# EAGLE design lightningbugsinajar (EAGLE 7.2.0)
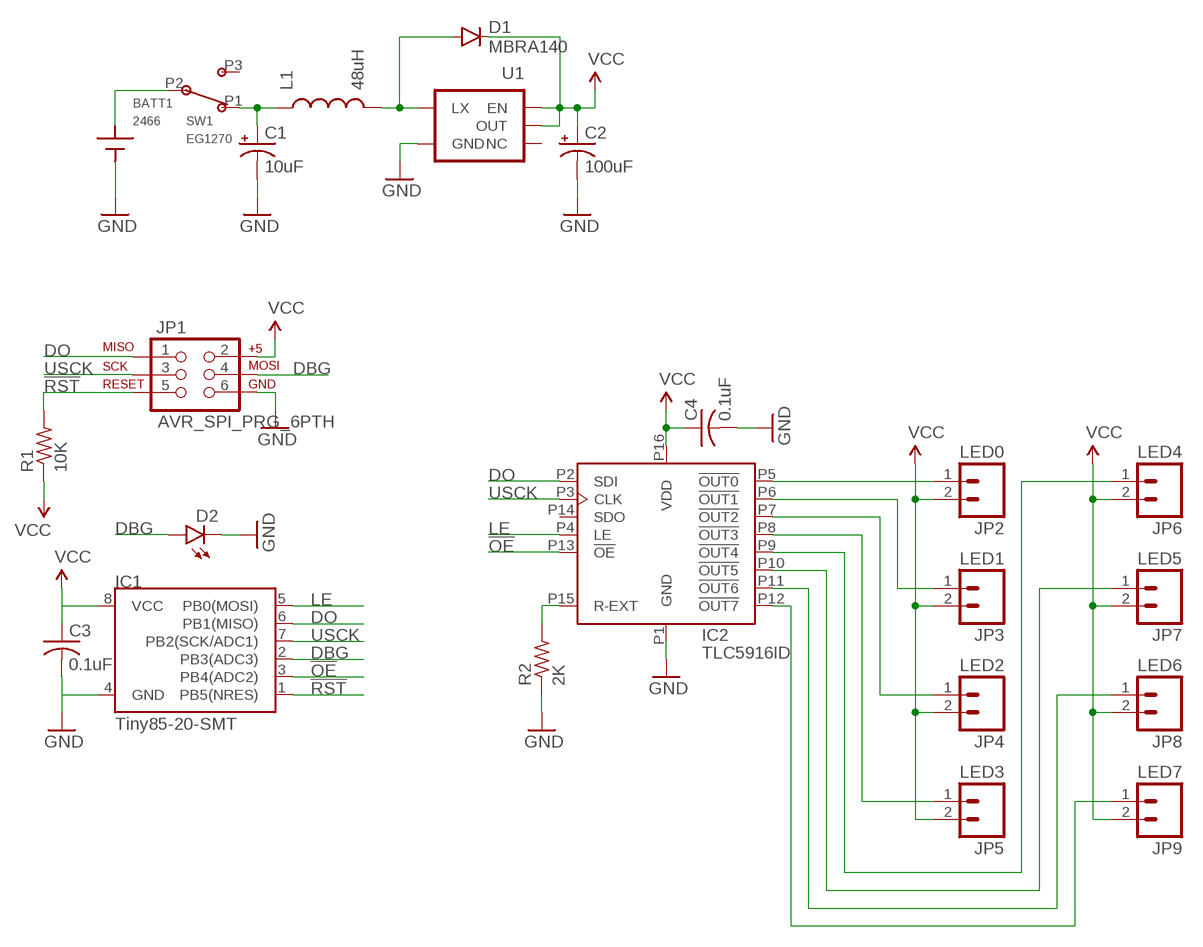
[diagram p0: schematic, sheet 1]

## Parts
BATT1  2466  [2466]
C1  10uF  CAP_POL3528  [EIA3528]
C2  100uF  CAP_POL3528  [EIA3528]
C3  0.1uF  C-USC0805  [C0805]
C4  0.1uF  C-USC0805  [C0805]
D1  MBRA140  DIODESMA  [SMA-DIODE]
D2  LED3MM  [LED3MM]
IC1  Tiny85-20-SMT  ATTINY45TINY85-20-SMT  [SO08-EIAJ]
IC2  TLC5916ID  [SOIC-16]
JP1  AVR_SPI_PRG_6PTH  [2X3]
JP2  LED0  M02PTH  [1X02]
JP3  LED1  M02PTH  [1X02]
JP4  LED2  M02PTH  [1X02]
JP5  LED3  M02PTH  [1X02]
JP6  LED4  M02PTH  [1X02]
JP7  LED5  M02PTH  [1X02]
JP8  LED6  M02PTH  [1X02]
JP9  LED7  M02PTH  [1X02]
L1  48uH  INDUCTORCR54  [CR54]
R1  10K  R-US_R0805  [R0805]
R2  2K  R-US_R0805  [R0805]
SW1  EG1270  [EG1270]
U1  V_REG_NCP1400SOT23-5  [SOT23-5]

## Nets
!OE: IC1.3(PB4(ADC2)) IC2.P13(!OE)
!RST: IC1.1(PB5(NRES)) JP1.5 R1.2
DBG: D2.A IC1.2(PB3(ADC3)) JP1.4
DO: IC1.6(PB1(MISO)) IC2.P2(SDI) JP1.1
GND: BATT1.NEG C1.C(-) C2.C(-) C3.2 C4.2 D2.K(C) IC1.4(GND) IC2.P1(GND) JP1.6 R2.1 U1.4(GND)
LE: IC1.5(PB0(MOSI)) IC2.P4(LE)
N$1: C1.A(+) L1.P$1 SW1.P1
N$2: D1.A L1.P$2 U1.5(LX)
N$3: IC2.P5(!OUT0) JP2.1
N$4: IC2.P15(R-EXT) R2.2
N$5: IC2.P6(!OUT1) JP3.1
N$6: IC2.P7(!OUT2) JP4.1
N$7: IC2.P8(!OUT3) JP5.1
N$8: IC2.P9(!OUT4) JP6.1
N$9: IC2.P10(!OUT5) JP7.1
N$10: BATT1.POS SW1.P2(COM)
N$11: IC2.P11(!OUT6) JP8.1
N$12: IC2.P12(!OUT7) JP9.1
USCK: IC1.7(PB2(SCK/ADC1)) IC2.P3(CLK) JP1.3
VCC: C2.A(+) C3.1 C4.1 D1.C IC1.8(VCC) IC2.P16(VDD) JP1.2 JP2.2 JP3.2 JP4.2 JP5.2 JP6.2 JP7.2 JP8.2 JP9.2 R1.1 U1.1(EN) U1.2(OUT)
Unconnected: IC2.P14(SDO) U1.3(NC)

## Power pins joined to a net without a drawn wire
3: SW1.P3

## Library data of the parts
BATT1 = custom:2466: Keystone Electronics. AAA battery holder.
C1 C2 = SparkFun-Passives:CAP_POL: Capacitor Polarized These are standard SMD and PTH capacitors. Normally 10uF, 47uF, and 100uF in electrolytic and tantalum varieties. Always verify the external diameter of the through hole cap, it varies with capacity, voltage, and manufacturer. The EIA devices should be standard.
C3 C4 = rcl:C-US: CAPACITOR, American symbol
D1 = SparkFun-DiscreteSemi:DIODE: Diode These are standard reverse protection diodes and small signal diodes. SMA package can handle up to about 1A. SOD-323 can handle about 200mA. What the SOD-323 package when ordering, there are some mfgs out there that are 5-pin packages.
D2 = SparkFun-LED:LED: LEDs Standard schematic elements and footprints for 5mm, 3mm, 1206, and 0603 sized LEDs. 5mm - Spark Fun Electronics SKU : COM-00529 (and others)
IC1 = SparkFun-DigitalIC:ATTINY45: Atmel 8-pin 2/4/8kB flash uC; PROD_ID: IC-09092
IC2 = custom:TLC591*?
JP1 = SparkFun-Connectors:AVR_SPI_PRG_6: AVR ISP 6 Pin This is the reduced ISP connector for AVR programming. Common on Arduino. This footprint will take up less PCB space and can be used with a 10-pin to 6-pin adapter such as SKU: BOB-08508 **Special note about "TEST_POINT" package. The stop mask is on the top side, so if you want your programming test points to be on the bottom of your board, make sure to place this package on the bottom side of the board. This also ensure that the orientation to program from the bottom side will be correct.
JP2-JP9 = SparkFun-Connectors:M02: Standard 2-pin 0.1" header. Use with - straight break away headers ( PRT-00116) - right angle break away headers (PRT-00553) - swiss pins (PRT-00743) - machine pins (PRT-00117) - female headers (PRT-00115) Molex polarized connector foot print use with: PRT-08233 with associated crimp pins and housings. 2.54_SCREWTERM for use with PRT-10571. 3.5mm Screw Terminal footprints for PRT-08084 5mm Screw Terminal footprints for use with PRT-08432
L1 = SparkFun-Passives:INDUCTOR: Inductors Basic Inductor/Choke - 0603 and 1206. Footprints are not proven and vary greatly between part numbers. INDUCTOR POWER 3.3UH 4.0A SMD 0.197" L x 0.197" W x 0.177" H (5.00mm x 5.00mm x 4.50mm)
R1 R2 = rcl:R-US_: RESISTOR, American symbol
SW1 = custom:EG1270: E-Switch. SPDT slide switch. PTH.
U1 = SparkFun-PowerIC:V_REG_NCP1400: Switching step-up voltage regulator NCP1400 switiching regulator takes single cell AA and outputs 100mA at 3.3V or 5V with minimal number of external components.

## Board
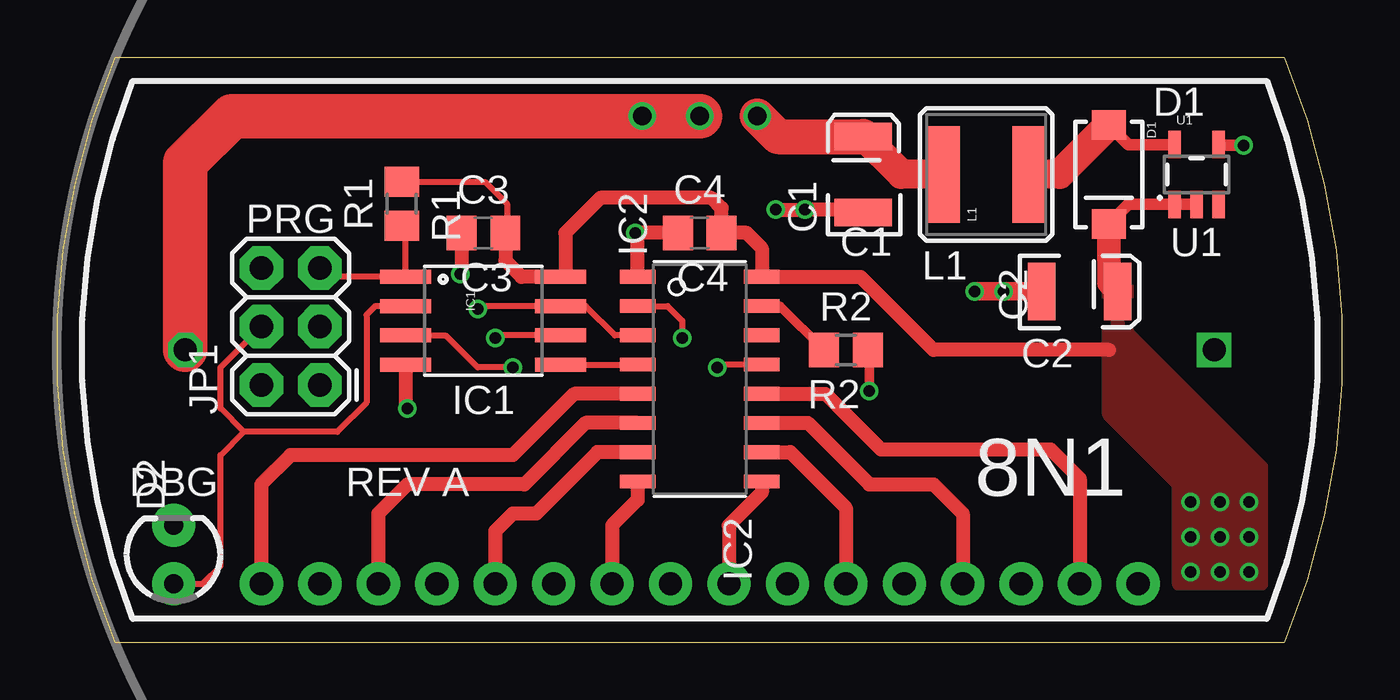
[diagram p1: board, top side]
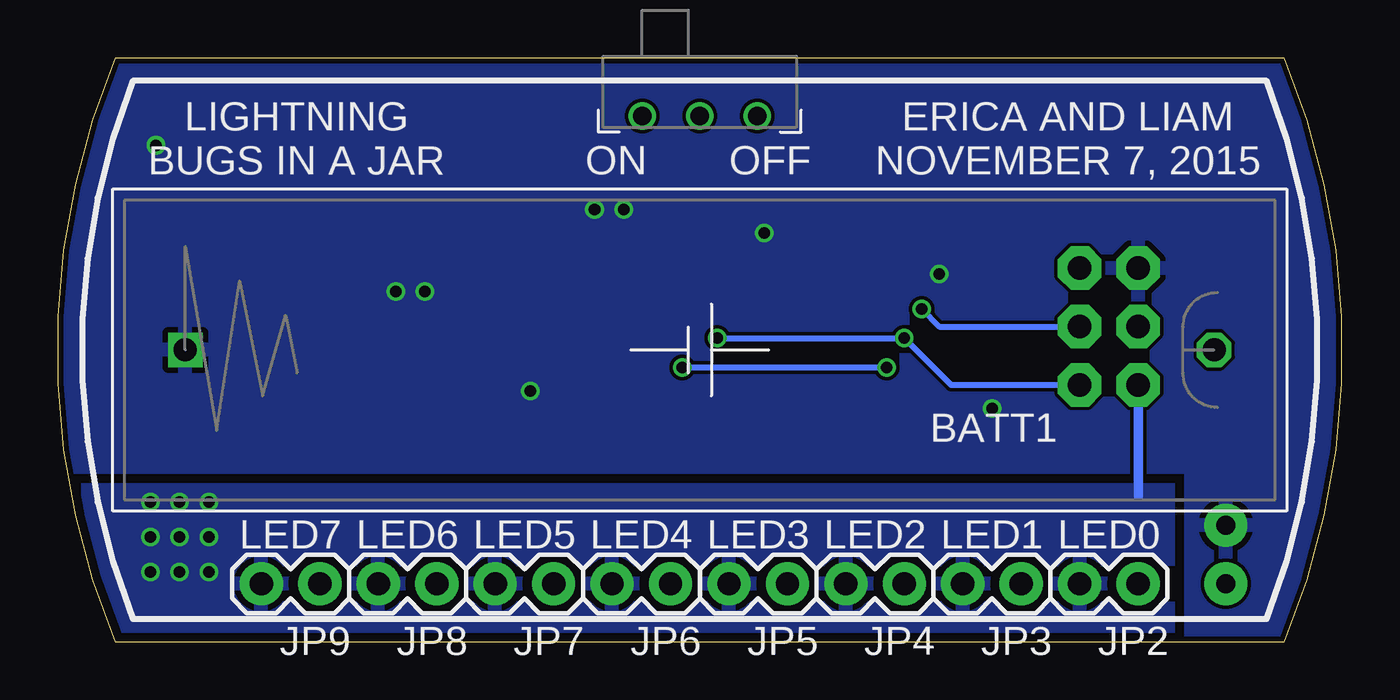
[diagram p2: board, bottom side, seen from below]

Size 55.82 x 25.4 mm. Coordinates in mm from the lower left corner, seen from the top.
Outline: 2.51,0 53.31,0 arc45 53.31,25.4 2.51,25.4 arc45 2.51,0
Copper layers (1*16): Top 0.035mm / dielectric 0.2mm / Bottom 0.035mm
Design rules "MF_2_Layer": minimum track width 6mil, minimum drill 12mil, track to track 6mil, track to pad 6mil, pad to pad 6mil, via to via 6mil, smd to smd 0mil, copper to edge 10mil, drill to drill 10mil, minimum pad ring 6mil, minimum via ring 6mil, stop-mask expansion 2mil, vias tented up to drill 25mil, thermal gap 10mil

### Footprints (pad centres in the part's own frame; a part is rotated, then mirrored left to right if it is on the bottom)
2466 = drill 1 square: NEG -22.352,0 | drill 1 octagon: POS 22.352,0
EIA3528 = smd 1.2 x 2.5: A 1.65,0; C -1.65,0
C0805 = smd 1.3 x 1.5: 1 -0.95,0; 2 0.95,0
SMA-DIODE = smd 1.27 x 1.47: A -2.15,0; C 2.15,0
LED3MM = drill 0.813 pad 1.88: A -1.27,0; K 1.27,0
SO08-EIAJ = smd 0.61 x 2.21: 1 -1.905,-3.378; 2 -0.635,-3.378; 3 0.635,-3.378; 4 1.905,-3.378; 5 1.905,3.353; 6 0.635,3.353; 7 -0.635,3.353; 8 -1.905,3.353
SOIC-16 = smd 0.6 x 1.55: P1 -4.445,-2.7; P2 -3.175,-2.7; P3 -1.905,-2.7; P4 -0.635,-2.7; P5 0.635,-2.7; P6 1.905,-2.7; P7 3.175,-2.7; P8 4.445,-2.7; P9 4.445,2.7; P10 3.175,2.7; P11 1.905,2.7; P12 0.635,2.7; P13 -0.635,2.7; P14 -1.905,2.7; P15 -3.175,2.7; P16 -4.445,2.7
2X3 = drill 1.016 pad 1.88 octagon: 1 0,0; 2 0,2.54; 3 2.54,0; 4 2.54,2.54; 5 5.08,0; 6 5.08,2.54
1X02 = drill 1.016 pad 1.88: 1 0,0; 2 2.54,0
CR54 = smd 4.2 x 1.4: P$1 0,1.85; P$2 0,-1.85
R0805 = smd 1.3 x 1.5: 1 -0.95,0; 2 0.95,0
EG1270 = drill 0.8: P1 -2.5,0; P2 0,0; P3 2.5,0
SOT23-5 = smd 0.55 x 1.2: 1 -0.95,-1.3; 2 0,-1.3; 3 0.95,-1.3; 4 0.95,1.3; 5 -0.95,1.3

### Placement (x,y rotation side)
BATT1  27.91,12.7 0 bottom
C1  35.02,20.32 90 top
C2  44.42,15.24 0 top
C3  18.51,17.78 180 top
C4  27.91,17.78 180 top
D1  45.69,20.32 270 top
D2  5.05,3.81 90 top
IC1  18.51,13.97 270 top
IC2  27.91,11.43 270 top
JP1  11.4,11.18 90 top
JP2  8.86,2.54 180 bottom
JP3  13.94,2.54 180 bottom
JP4  19.02,2.54 180 bottom
JP5  24.1,2.54 180 bottom
JP6  29.18,2.54 180 bottom
JP7  34.26,2.54 180 bottom
JP8  39.34,2.54 180 bottom
JP9  44.42,2.54 180 bottom
L1  40.35,20.32 90 top
R1  14.95,19.05 270 top
R2  34.26,12.7 180 top
SW1  27.91,22.86 0 bottom
U1  49.5,20.32 0 top

### Tracks (layer width: path | path; a pad name or v marks a point on that pad's centre or on a via)
!OE  (via drill 0.5)
  Top 0.254: IC2.P13 28.8,12.06 v28.67,11.94 | v19.78,11.94 18.26,11.94 16.86,13.34 IC1.3
  Bottom 0.254: v28.67,11.94 v19.78,11.94
!RST
  Top 0.254: JP1.5 11.78,15.88 IC1.1 15.13,17.92 R1.2
DBG
  Top 0.254: IC1.2 13.81,14.61 13.43,14.22 13.43,10.41 12.16,9.14 8.1,9.14 | 8.1,9.14 7.08,10.16 7.08,11.94 JP1.4 | D2.A 6.32,2.54 7.08,3.3 7.08,8.13 8.1,9.14
DO  (via drill 0.5)
  Top 0.254: IC1.6 19.15,13.34 v19.02,13.21 | IC2.P2 26.51,14.61 27.15,13.97 v27.15,13.21
  Bottom 0.254: JP1.1 16.99,11.18 v19.02,13.21 v27.15,13.21
GND  (via drill 0.5)
  Top 0.406: R2.1 35.27,12.63 v35.27,10.92
  Top 0.508: U1.4 50.48,21.59 v51.53,21.59
  Top 0.61: C4.2 v25.11,17.78 25.21,17.69 IC2.P1 | C3.2 17.56,16.07 v17.49,16 | IC1.4 15.13,10.24 v15.21,10.16 | v31.21,18.8 v32.48,18.8 34.89,18.8 C1.C
  Top 0.813: v39.85,15.24 v41.12,15.24 C2.C
  pour Bottom: -0.03,25.4 55.85,25.4 55.85,7.62 6.57,7.62 6.57,0 -0.03,0
LE
  Top 0.254: IC1.5 IC2.P4
N$1
  Top 1.27: L1.P$1 36.67,20.32 C1.A
  Top 1.524: SW1.P1 31.3,21.97 C1.A
N$2
  Top 0.508: D1.A 46.54,21.62 U1.5
  Top 1.27: D1.A 43.54,20.32 L1.P$2
N$3
  Top 0.61: IC2.P5 22.45,10.79 19.78,8.13 10.13,8.13 8.86,6.86 JP2.1
N$4
  Top 0.406: R2.2 31.4,14.61 IC2.P15
N$5
  Top 0.61: IC2.P6 22.96,9.53 20.29,6.86 15.21,6.86 13.94,5.59 JP3.1
N$6
  Top 0.61: IC2.P7 23.46,8.26 20.8,5.59 19.78,5.59 19.02,4.83 JP4.1
N$7
  Top 0.61: IC2.P8 25.21,6.19 24.1,5.08 JP5.1
N$8
  Top 0.61: IC2.P9 30.61,6.51 29.18,5.08 JP6.1
N$9
  Top 0.61: IC2.P10 31.85,8.26 34.26,5.84 JP7.1
N$10
  Top 1.93: BATT1.POS 5.56,20.83 7.59,22.86 SW1.P2
N$11
  Top 0.61: IC2.P11 32.61,9.53 35.27,6.86 38.07,6.86 39.34,5.59 JP8.1
N$12
  Top 0.61: IC2.P12 33.37,10.79 35.78,8.38 43.15,8.38 44.42,7.11 JP9.1
USCK  (via drill 0.5)
  Top 0.254: IC2.P3 24.23,13.34 22.96,14.61 IC1.7 18.38,14.61 v18.26,14.48
  Bottom 0.254: v18.26,14.48 17.49,13.72 JP1.3
VCC  (via drill 0.5)
  Top 0.254: R1.1 18.58,20 19.53,19.05 19.53,17.85 C3.1
  Top 0.508: D1.C 46.54,19.02 U1.1 U1.2
  Top 0.61: C3.1 19.46,16.58 20.16,15.88 IC1.8 22.07,16.08 22.07,17.78 23.59,19.3 28.42,19.3 28.86,18.86 C4.1 29.94,17.78 30.61,17.11 IC2.P16 34.89,15.88 38.07,12.7 45.69,12.7
  Top 1.016: C2.A 45.69,15.62 D1.C
  Bottom 0.406: JP1.2 8.86,6.35
  other vias: 49.24,6.1 50.51,6.1 51.78,6.1 49.24,4.57 50.51,4.57 51.78,4.57 49.24,3.05 50.51,3.05 51.78,3.05
  pour Bottom (isolate 0.406, rank 2): -0.03,0 -0.03,7.62 55.85,7.62 55.85,0
  pour Top: 48.74,2.54 48.74,6.86 45.69,9.91 45.69,15.49 46.45,15.49 46.45,13.46 52.29,7.62 52.29,2.54

### Text on the board
tPlace: D1 | C1 | R1 | C3 | C4 | PRG | IC2 | U1 | L1 | R2 | C2 | IC1 | DBG | REV A | 8N1
bPlace: ERICA AND LIAM / NOVEMBER 7, 2015 | OFF | ON | LIGHTNING / BUGS IN A JAR | LED0 | LED1 | LED2 | LED3 | LED4 | LED5 | LED6 | LED7